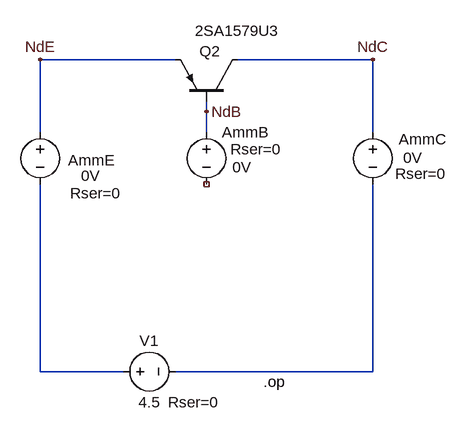
[diagram p0: schematic leakage_current_01.asc]
leakage_current_01.asc, the LTspice schematic file:
Version 4
SHEET 1 880 768
WIRE -80 176 -288 176
WIRE 224 176 16 176
WIRE -32 256 -32 240
WIRE -288 288 -288 176
WIRE -32 288 -32 256
WIRE 224 288 224 176
WIRE -288 656 -288 368
WIRE -160 656 -288 656
WIRE 224 656 224 368
WIRE 224 656 -80 656
FLAG -288 176 NdE
FLAG -32 256 NdB
FLAG 224 176 NdC
SYMBOL pnp 16 240 M270
WINDOW 0 77 59 VLeft 2
WINDOW 3 108 66 VLeft 2
SYMATTR InstName Q2
SYMATTR Value 2SA1579U3
SYMBOL voltage -288 272 R0
WINDOW 0 43 59 Left 2
WINDOW 3 63 83 Left 2
WINDOW 123 0 0 Left 0
WINDOW 39 46 110 Left 2
SYMATTR InstName AmmE
SYMATTR Value 0V
SYMATTR SpiceLine Rser=0
SYMBOL voltage -32 272 R0
WINDOW 3 40 70 Left 2
WINDOW 123 0 0 Left 0
WINDOW 39 37 42 Left 2
SYMATTR Value 0V
SYMATTR SpiceLine Rser=0
SYMATTR InstName AmmB
SYMBOL voltage 224 272 R0
WINDOW 0 40 27 Left 2
WINDOW 3 47 55 Left 2
WINDOW 123 0 0 Left 0
WINDOW 39 35 80 Left 2
SYMATTR InstName AmmC
SYMATTR Value 0V
SYMATTR SpiceLine Rser=0
SYMBOL voltage -176 656 R270
WINDOW 0 32 56 VTop 2
WINDOW 3 -32 56 VBottom 2
WINDOW 123 0 0 Left 0
WINDOW 39 -32 124 VBottom 2
SYMATTR InstName V1
SYMATTR Value 4.5
SYMATTR SpiceLine Rser=0
TEXT 56 672 Left 2 !.op

The netlist it stands for:
* leakage_current_01.asc
Q2 NdC NdB NdE 0 2SA1579U3
V§AmmE NdE N001 0V Rser=0
V§AmmB NdB NC_01 0V Rser=0
V§AmmC NdC N002 0V Rser=0
V1 N001 N002 4.5 Rser=0
.model NPN NPN
.model PNP PNP
.lib standard.bjt
.op
.backanno
.end